# Altium schematic sheet MainPage.SchDoc
size A4; SheetNumber: 1; SheetTotal: 6
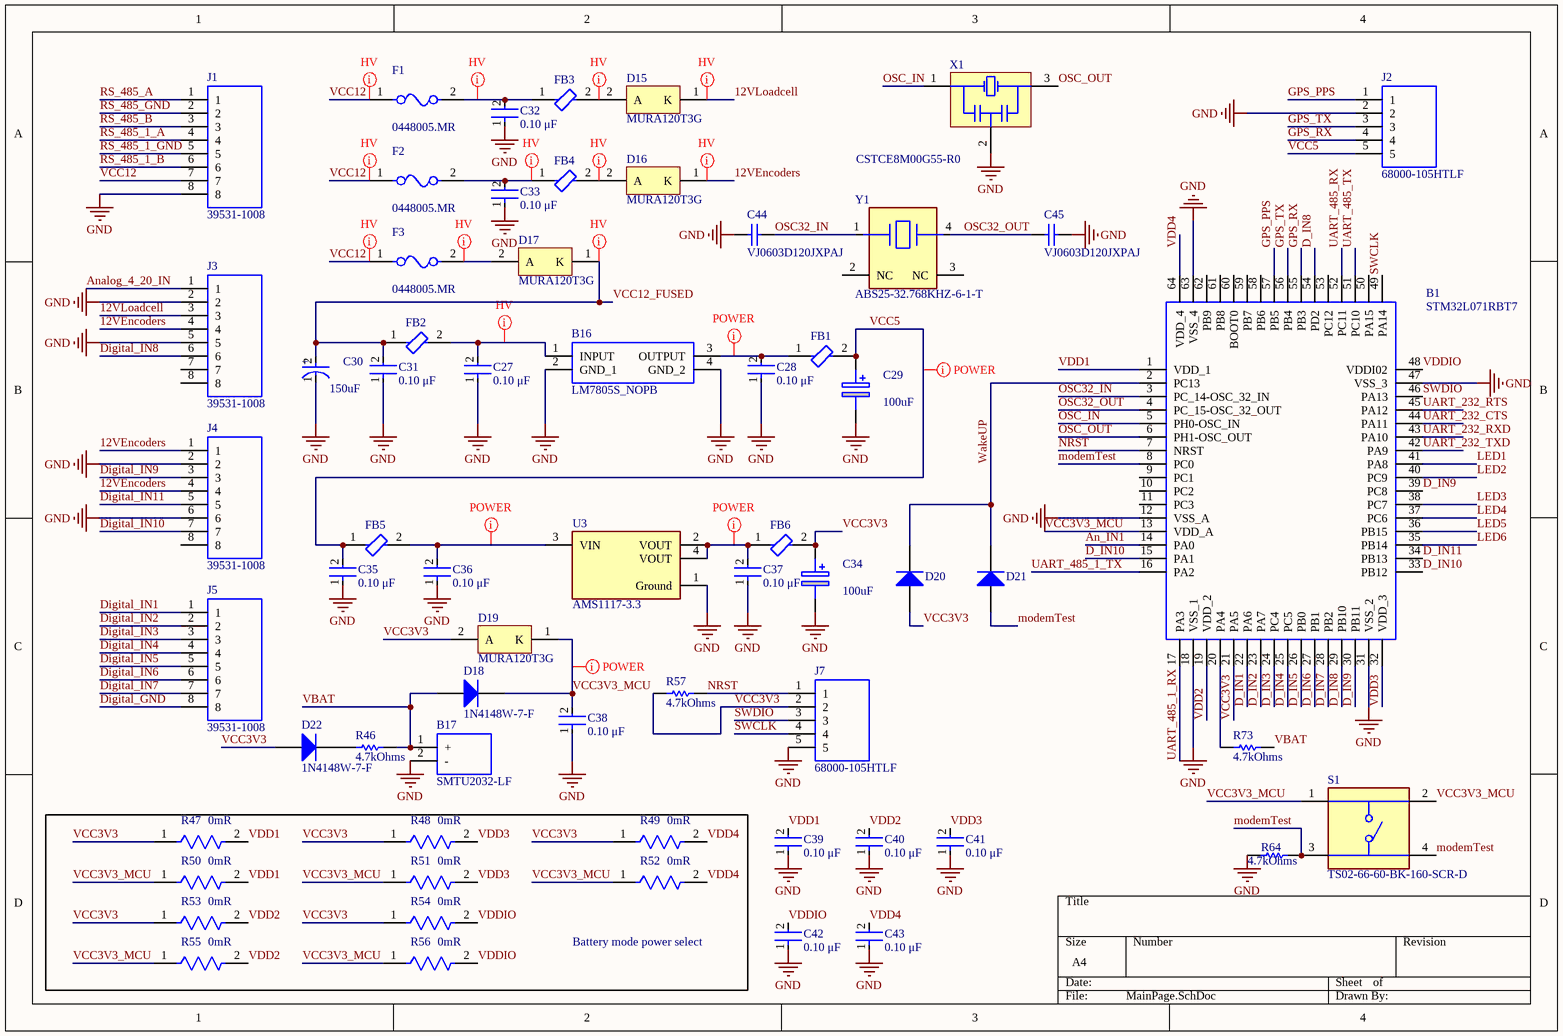
[diagram p0: MainPage.SchDoc]

## Parts
B1  STM32L071RBT7  [QFP50P1200X1200X160-64N]
B16  LM7805S_NOPB  [KTT0003B]
B17  SMTU2032-LF  [SMTU2032LF]
C27  value 0.10 μF  [FP-C0805C-DN-MFG]  (hidden comment: C0805C104K5RAC7411)
C28  value 0.10 μF  [FP-C0805C-DN-MFG]  (hidden comment: C0805C104K5RAC7411)
C29  Capacitance: 100uF  [T520B]  (hidden comment: T520B107M006ATE040)
C30  Capacitance: 150uF  [FP-TAJE-MFG]  (hidden comment: TAJE157K020RNJ)
C31  value 0.10 μF  [FP-C0805C-DN-MFG]  (hidden comment: C0805C104K5RAC7411)
C32  value 0.10 μF  [FP-C0805C-DN-MFG]  (hidden comment: C0805C104K5RAC7411)
C33  value 0.10 μF  [FP-C0805C-DN-MFG]  (hidden comment: C0805C104K5RAC7411)
C34  Capacitance: 100uF  [T520B]  (hidden comment: T520B107M006ATE040)
C35  value 0.10 μF  [FP-C0805C-DN-MFG]  (hidden comment: C0805C104K5RAC7411)
C36  value 0.10 μF  [FP-C0805C-DN-MFG]  (hidden comment: C0805C104K5RAC7411)
C37  value 0.10 μF  [FP-C0805C-DN-MFG]  (hidden comment: C0805C104K5RAC7411)
C38  value 0.10 μF  [FP-C0805C-DN-MFG]  (hidden comment: C0805C104K5RAC7411)
C39  value 0.10 μF  [FP-C0805C-DN-MFG]  (hidden comment: C0805C104K5RAC7411)
C40  value 0.10 μF  [FP-C0805C-DN-MFG]  (hidden comment: C0805C104K5RAC7411)
C41  value 0.10 μF  [FP-C0805C-DN-MFG]  (hidden comment: C0805C104K5RAC7411)
C42  value 0.10 μF  [FP-C0805C-DN-MFG]  (hidden comment: C0805C104K5RAC7411)
C43  value 0.10 μF  [FP-C0805C-DN-MFG]  (hidden comment: C0805C104K5RAC7411)
C44  VJ0603D120JXPAJ  [CAPC1608X92X38LL15T08]
C45  VJ0603D120JXPAJ  [CAPC1608X92X38LL15T08]
D15  MURA120T3G  [ONSC-SMA-2-403D-02_V]
D16  MURA120T3G  [ONSC-SMA-2-403D-02_V]
D17  MURA120T3G  [ONSC-SMA-2-403D-02_V]
D18  1N4148W-7-F  [DIOD-SOD123-2_V]
D19  MURA120T3G  [ONSC-SMA-2-403D-02_V]
D20  1N4148W-7-F  [DIOD-SOD123-2_V]  (value not drawn)
D21  1N4148W-7-F  [DIOD-SOD123-2_V]  (value not drawn)
D22  1N4148W-7-F  [DIOD-SOD123-2_V]
F1  0448005.MR  [FP-0448-MFG]
F2  0448005.MR  [FP-0448-MFG]
F3  0448005.MR  [FP-0448-MFG]
FB1  BLM41PG181SH1L  [FP-BLM41-0_2-a1_2-MFG]  (value not drawn)
FB2  BLM41PG181SH1L  [FP-BLM41-0_2-a1_2-MFG]  (value not drawn)
FB3  BLM41PG181SH1L  [FP-BLM41-0_2-a1_2-MFG]  (value not drawn)
FB4  BLM41PG181SH1L  [FP-BLM41-0_2-a1_2-MFG]  (value not drawn)
FB5  BLM41PG181SH1L  [FP-BLM41-0_2-a1_2-MFG]  (value not drawn)
FB6  BLM41PG181SH1L  [FP-BLM41-0_2-a1_2-MFG]  (value not drawn)
J1  39531-1008  [RHDR8W140P0X508_1X8_4264X830X1240P]
J2  68000-105HTLF  [HDRV5W67P0X254_1X5_1270X241X858P]
J3  39531-1008  [RHDR8W140P0X508_1X8_4264X830X1240P]
J4  39531-1008  [RHDR8W140P0X508_1X8_4264X830X1240P]
J5  39531-1008  [RHDR8W140P0X508_1X8_4264X830X1240P]
J7  68000-105HTLF  [HDRV5W67P0X254_1X5_1270X241X858P]
R46  Resistance: 4.7kOhms  [RESC1608X55X25LL10T15]  (hidden comment: RC0603FR-074K7L)
R47  Resistance: 0mR  [FP-CRCW0603-HPe3-MFG]  (hidden comment: CRCW06030000Z0EAHP)
R48  Resistance: 0mR  [FP-CRCW0603-HPe3-MFG]  (hidden comment: CRCW06030000Z0EAHP)
R49  Resistance: 0mR  [FP-CRCW0603-HPe3-MFG]  (hidden comment: CRCW06030000Z0EAHP)
R50  Resistance: 0mR  [FP-CRCW0603-HPe3-MFG]  (hidden comment: CRCW06030000Z0EAHP)
R51  Resistance: 0mR  [FP-CRCW0603-HPe3-MFG]  (hidden comment: CRCW06030000Z0EAHP)
R52  Resistance: 0mR  [FP-CRCW0603-HPe3-MFG]  (hidden comment: CRCW06030000Z0EAHP)
R53  Resistance: 0mR  [FP-CRCW0603-HPe3-MFG]  (hidden comment: CRCW06030000Z0EAHP)
R54  Resistance: 0mR  [FP-CRCW0603-HPe3-MFG]  (hidden comment: CRCW06030000Z0EAHP)
R55  Resistance: 0mR  [FP-CRCW0603-HPe3-MFG]  (hidden comment: CRCW06030000Z0EAHP)
R56  Resistance: 0mR  [FP-CRCW0603-HPe3-MFG]  (hidden comment: CRCW06030000Z0EAHP)
R57  Resistance: 4.7kOhms  [RESC1608X55X25LL10T15]  (hidden comment: RC0603FR-074K7L)
R64  Resistance: 4.7kOhms  [RESC1608X55X25LL10T15]  (hidden comment: RC0603FR-074K7L)
R73  Resistance: 4.7kOhms  [RESC1608X55X25LL10T15]  (hidden comment: RC0603FR-074K7L)
S1  TS02-66-60-BK-160-SCR-D  [SW_TS02-66-60-BK-160-SCR-D]
U3  AMS1117-3.3  [FP-AMS1117-IPC_C]
X1  CSTCE8M00G55-R0  [MURA-CSTCE_G_A-3_V]
Y1  ABS25-32.768KHZ-6-1-T  [FP-ABS25-MFG]

## Blocks framed on the sheet
Battery mode power select: R47-R56

## Nets
GND: B1.12(VSS_A) B1.18(VSS_1) B1.31(VSS_2) B1.47(VSS_3) B1.63(VSS_4) B16.2(GND_1) B16.4(GND_2) B17.2(-) C27.1 C28.1 C29.2(-) C30.1(C) C31.1 C32.1 C33.1 C34.2(-) C35.1 C36.1 C37.1 C38.1 C39.1 C40.1 C41.1 C42.1 C43.1 C44.1 C45.2 J1.8 J2.2 J3.2 J3.5 J4.2 J4.6 J7.5 R64.2 U3.1(Ground) X1.2(GND)
12VEncoders: D16.1(K) J3.4 J4.1 J4.4
12VLoadcell: D15.1(K) J3.3
An_IN1: B1.14(PA0)
Analog_4_20_IN: J3.1
D_IN1: B1.22(PA6)
D_IN2: B1.23(PA7)
D_IN3: B1.24(PC4)
D_IN4: B1.25(PC5)
D_IN5: B1.26(PB0)
D_IN6: B1.27(PB1)
D_IN7: B1.28(PB2)
D_IN8: B1.29(PB10) B1.54(PD2)
D_IN9: B1.30(PB11) B1.39(PC8)
D_IN10: B1.15(PA1) B1.33(PB12)
D_IN11: B1.34(PB13)
Digital_GND: J5.8
Digital_IN1: J5.1
Digital_IN2: J5.2
Digital_IN3: J5.3
Digital_IN4: J5.4
Digital_IN5: J5.5
Digital_IN6: J5.6
Digital_IN7: J5.7
Digital_IN8: J3.6
Digital_IN9: J4.3
Digital_IN10: J4.7
Digital_IN11: J4.5
GPS_PPS: B1.57(PB5) J2.1
GPS_RX: B1.55(PB3) J2.4
GPS_TX: B1.56(PB4) J2.3
LED1: B1.41(PA8)
LED2: B1.40(PC9)
LED3: B1.38(PC7)
LED4: B1.37(PC6)
LED5: B1.36(PB15)
LED6: B1.35(PB14)
modemTest: B1.8(PC0) D21.1(A) R64.1 S1.3 S1.4
NRST: B1.7(NRST) J7.1 R57.1
OSC32_IN: B1.3(PC_14-OSC_32_IN) C44.2 Y1.1
OSC32_OUT: B1.4(PC_15-OSC_32_OUT) C45.1 Y1.4
OSC_IN: B1.5(PH0-OSC_IN) X1.1(X1)
OSC_OUT: B1.6(PH1-OSC_OUT) X1.3(X2)
RS_485_1_A: J1.4
RS_485_1_B: J1.6
RS_485_1_GND: J1.5
RS_485_A: J1.1
RS_485_B: J1.3
RS_485_GND: J1.2
SWCLK: B1.49(PA14) J7.4
SWDIO: B1.46(PA13) J7.3
UART_232_CTS: B1.44(PA11)
UART_232_RTS: B1.45(PA12)
UART_232_RXD: B1.43(PA10)
UART_232_TXD: B1.42(PA9)
UART_485_1_RX: B1.17(PA3)
UART_485_1_TX: B1.16(PA2)
UART_485_RX: B1.52(PC11)
UART_485_TX: B1.51(PC10)
VBAT: B17.1(+) D18.1(A) R46.1 R73.1
VCC3V3: B1.21(PA5) C34.1(+) D19.2(A) D20.1(A) D22.1(A) FB6.2 J7.2 R47.1 R48.1 R49.1 R53.1 R54.1 R57.2
VCC3V3_MCU: B1.13(VDD_A) C38.2 D18.2(K) D19.1(K) R50.1 R51.1 R52.1 R55.1 R56.1 S1.1 S1.2
VCC5: C29.1(+) C35.2 FB1.2 FB5.1 J2.5
VCC12: F1.1 F2.1 F3.1 J1.7
VCC12_FUSED: C30.2(A) C31.2 D17.1(K) FB2.1
VDD1: B1.1(VDD_1) C39.2 R47.2 R50.2
VDD2: B1.19(VDD_2) C40.2 R53.2 R55.2
VDD3: B1.32(VDD_3) C41.2 R48.2 R51.2
VDD4: B1.64(VDD_4) C43.2 R49.2 R52.2
VDDIO: B1.48(VDDI02) C42.2 R54.2 R56.2
WakeUP: B1.2(PC13) D20.2(K) D21.2(K)
NetB1_20: B1.20(PA4) R73.2
NetB16_1: B16.1(INPUT) C27.2 FB2.2
NetB16_3: B16.3(OUTPUT) C28.2 FB1.1
NetC32_2: C32.2 F1.2 FB3.1
NetC33_2: C33.2 F2.2 FB4.1
NetC36_2: C36.2 FB5.2 U3.3(VIN)
NetC37_2: C37.2 FB6.1 U3.2(VOUT) U3.4(VOUT)
NetD15_2: D15.2(A) FB3.2
NetD16_2: D16.2(A) FB4.2
NetD17_2: D17.2(A) F3.2
NetD22_2: D22.2(K) R46.2

Not connected (* = marked no-connect by the designer): B1 9(PC1) 10(PC2) 11(PC3) 50(PA15) 53(PC12) 58(PB6) 59(PB7) 60(BOOT0) 61(PB8) 62(PB9); J3 7 8; J4 8; Y1 2(NC) 3(NC)

## Layout directives
net class HV: 12VEncoders, 12VLoadcell, NetB16_1, NetC32_2, NetC33_2, NetD15_2, NetD16_2, NetD17_2, VCC12, VCC12_FUSED
net class POWER: NetB16_3, NetC36_2, NetC37_2, VCC3V3_MCU, VCC5

## Notes on the sheet
- (in symbol CMP-2000-07229-2) +

## Library data of the parts
B1 = STM32L071RBT7: ARM Microcontrollers - MCU 16/32-BITS MICROS; Manufacturer_Name: STMicroelectronics; Geometry.Height: 1.6mm; Mouser Part Number: 511-STM32L071RBT7; Mouser Price/Stock: https://www.mouser.co.uk/ProductDetail/STMicroelectronics/STM32L071RBT7?qs=qzCNEk%252BRr%252BZjEtOUFC%252Bu7w%3D%3D; Manufacturer_Part_Number: STM32L071RBT7; Datasheet Link: http://www.st.com/content/ccc/resource/technical/document/datasheet/b5/24/80/11/51/59/47/f7/DM00141136.pdf/files/DM00141136.pdf/jcr:content/translations/en.DM00141136.pdf
B16 = LM7805S_NOPB: 1.5-A, Wide VIN Fixed Voltage Regulators; Manufacturer_Name: Texas Instruments; Manufacturer_Part_Number: LM7805S/NOPB; Mouser Part Number: 595-LM7805S/NOPB; Mouser Price/Stock: https://www.mouser.co.uk/ProductDetail/Texas-Instruments/LM7805S-NOPB?qs=9V2QonpqdTu8D%252Bva6DasHQ%3D%3D; Datasheet Link: http://www.ti.com/lit/gpn/lm7800
B17 = SMTU2032-LF: Coin Cell Battery Holders SFC MNT FOR CR2032; Manufacturer_Name: RENATA; Geometry.Height: 5mm; Mouser Part Number: 614-SMTU2032-LF; Mouser Price/Stock: https://www.mouser.co.uk/ProductDetail/Renata/SMTU2032-LF?qs=r1PAtlylphCLeXbokB9Tog%3D%3D; Manufacturer_Part_Number: SMTU2032-LF; Datasheet Link: https://componentsearchengine.com/Datasheets/1/SMTU2032-LF.pdf
C27 C28 C31-C33 C35-C43 = CMP-2007-00277-3: C0805 0.10 μF X7R 30ppm/°C 10.00% 50 V; Manufacturer: KEMET; Material: Ceramic; Tolerance: 0.1; Voltage Rating: 50 V; Temperature: -55°C to +125°C; Device Class L3: Ceramic Capacitors; Temperature Characteristic: X7R; Device Class L1: Passive Components; Category: Cap; Temperature Coefficient: 30ppm/°C; Manufacturer Part Number: C0805C104K5RAC7411; Temperature Range High: +125°C; Height: 0.88mm; RoHS: TRUE; ComponentLink2Description: Datasheet; Lead Free: Yes; Capacitance: 0.10 μF; Package: C0805C-DN; Temperature Range Low: -55°C; ComponentLink2URL: https://content.kemet.com/datasheets/KEM_C1003_C0G_SMD.pdf; Automotive: No; Ipc Land Pattern Name: CAPC200125X78; Octopart: https://octopart.com/c0805c104k5rac7411-kemet-18508045; Device Class L2: Capacitors
C29 C34 = T520B107M006ATE040: T520, Tantalum, Polymer Tantalum, Commercial Grade, 100 uF, 20%, 6.3 VDC, 105C, -55C, 105C, SMD, Polymer, Molded, Low ESR, Non-Combustible, 2,000 Hrs, 8 % , 40 mOhms, 63 uA, 94.85 mg, 3528, 1.9mm, Height Max = 2mm, 2000, 52  Weeks; Manufacturer_Name: KEMET; Mouser Part Number: 80-T520B107M6ATE40; Mouser Price/Stock: https://www.mouser.co.uk/ProductDetail/KEMET/T520B107M006ATE040?qs=A%2FUypIgi4aDLVIJ%2FABrGAw%3D%3D; Manufacturer_Part_Number: T520B107M006ATE040; Datasheet Link: https://content.kemet.com/datasheets/KEM_T2076_T52X-530.pdf; Geometry.Height: 2mm
C30 = CMP-2000-07229-2: 150uF 20V  ±10% 300mΩ 2917  SMD Tantalum Capacitor; Dissipation Factor: 8%; ESR (Equivalent Series Resistance): 300mR; Polarity: Polar; Leakage Current: 30uA; Dielectric Material: Tantalum; Height: 4.3mm; RoHS Compliant: Yes; Mount: Surface Mount; Voltage Rating: 20V; REACH SVHC: No SVHC; Height - Seated (Max): 0.169inch; Case Code (Imperial): 2917; Termination: SMD/SMT; Features: General Purpose; Case/Package: 2917; Max Operating Temperature: 125°C; Length: 7.3mm; Width: 4.3mm; Radiation Hardening: No; Construction: Flat; Voltage Rating (DC): 20V; Lead Free: Lead Free; Depth: 4.3mm; Tolerance: 10%; Series: TAJ; Min Operating Temperature: -55°C; Package Quantity: 1; Number of Pins: 2; Packaging: Tape and Reel; Case Code (Metric): 7343
C44 C45 = CMP-2006-01491-1: Manufacturer: Vitramon; Part Number: VJ0603D120JXPAJ
D15-D17 D19 = CMP-0902-00292-1: Surface Mount Ultrafast Power Rectifier, 2-Pin SMA, Pb-Free, Tape and Reel; Manufacturer: On Semiconductor; IFSM Max (A): 40; RoHS: TRUE; PackageVersion: Rev. G, 07/2012; DatasheetVersion: Rev. 8; Packing: Tape and Reel; ComponentLink2Description: Datasheet; ComponentLink3Description: Package Specification; ComponentLink2URL: http://www.onsemi.cn/pub_link/Collateral/MURA115T3-D.PDF; ComponentLink1URL: http://www.onsemi.com/; PartNumber: MURA120T3G; ComponentLink1Description: Manufacturer URL; Mounting Technology: Surface Mount; PackageDescription: 2-Pin Small Molded Package, J-Bend Lead, Body 2.605 x 4.315 mm; ComponentLink3URL: http://www.onsemi.com/pub_link/Collateral/403D-02.PDF; Type: Ultrafast; PackageReference: SMA-2-403D-02
D18 D20-D22 = CMP-2000-04932-2: Fast Switching Diode, 100 V, 0.15 A, -65 to 150 degC, 2-Pin?SOD123, RoHS, Tape and Reel; Recovery Time: 4ns; Brand: DiodesIncorporated; Unit Weight: 0.000353oz; Max Surge Current: 2A; Peak Reverse Voltage: 100V; Ir - Reverse Current: 1uA; Vf - Forward Voltage: 1.25V; Configuration: Single; If - Forward Current: 0.15A; Product Category: Diodes-GeneralPurpose,Power,Switching; Operating Temperature Range: -65Cto+150C; Packaging: Reel; Manufacturer URL: http://www.diodes.com/; Maximum Operating Temperature: +150C; Height: 1.25mm; Minimum Operating Temperature: -65C; Product: SwitchingDiodes; Package URL: http://www.diodes.com/datasheets/ds18004.pdf; Type: SwitchingDiode; Package Reference: SOD123-2; Width: 1.7mm; Datasheet URL: http://www.farnell.com/datasheets/1915529.pdf; Datasheet Version: Rev. 24-2, 10/2013; Series: 1N4148; Factory Pack Quantity: 3000; Length: 2.85mm; RoHS: True; Manufacturer: DiodesIncorporated; Mounting Style: SMD/SMT; Package / Case: SOD-123
F1-F3 = CMP-2000-05188-2: FUSE BRD MNT 5A 125VAC/VDC 2SMD; Manufacturer: Littelfuse; Max Fuse Ac Voltage: 125V; Fuse Blow Speed: Fast; Fuse Interrupt Ac Current: 50A; Value: 0.01531Ω; Fuse I2T: 4.49A2Sec; Device Class L3: unset; Lead Free: Yes; RoHS: TRUE; Max Fuse Dc Voltage: 125V; Mouser Description: Fuse Chip Very Fast Acting 5A 125V SMD Solder Pad 2410 Ceramic T/R CSA/PSE/UL; Package: 0448; Manufacturer Part Number: 0448005.MR; Device Class L2: Fuses; Fuse Current: 5A; Device Class L1: Circuit Protection; Octopart: https://octopart.com/0448005.mr-littelfuse-672815; ComponentLink2URL: https://www.littelfuse.com/~/media/electronics/datasheets/fuses/littelfuse_fuse_448_datasheet.pdf.pdf; Automotive: No; Digikey Description: FUSE BRD MNT 5A 125VAC/VDC 2SMD; Resistance: 0.01531Ω; Fuse Interrupt Dc Current: 50A; Temperature Range High: +125°C; Temperature: -55°C to +125°C; Voltage Rating: 125V; Category: Fuse; Height: 2.94mm; ComponentLink2Description: Datasheet; Temperature Range Low: -55°C
FB1-FB6 = CMP-06046-002023-1: Ferrite Bead, 1806, 180Ω @ 100MHz, 25%, 0.02Ω, 3.5A; Impedance: 180R; Number of Lines: 1; Max DC Current: 50mA; DC Resistance (DCR): 20mR; Mount: Surface Mount; Length: 4.5mm; Tolerance: 25%; Series: EMIFIL®, BLM41P; Package Quantity: 2500; Min Operating Temperature: -55°C; Max Operating Temperature: 125°C; Height: 0.071inch; Packaging: Tape and Reel; Contact Plating: Tin; Test Frequency: 100MHz; Ratings: AEC-Q200; Case Code (Metric): 4516; Termination: SMD/SMT; Case Code (Imperial): 1806; Width: 0.063inch; Max Current Rating: 3.5A; Case/Package: 1806
J1 J3-J5 = 39531-1008: Pluggable Terminal Blocks 5.08MM EURO HEADER VERT BLK 8CKT; Manufacturer_Name: Molex; Geometry.Height: 12.4mm; Mouser Part Number: 538-39531-1008; Mouser Price/Stock: https://www.mouser.co.uk/ProductDetail/Molex/39531-1008?qs=cJvWYcaovXy3iX%252BVkyK%252Bcg%3D%3D; Manufacturer_Part_Number: 39531-1008; Datasheet Link: https://www.molex.com/pdm_docs/sd/395311008_sd.pdf
J2 J7 = 68000-105HTLF: 68000-105HTLF-B/S SR HDR 1*5; Manufacturer_Name: Amphenol Communication Solutions; Geometry.Height: 8.58mm; Mouser Part Number: 649-68000-105HTLF; Mouser Price/Stock: https://www.mouser.co.uk/ProductDetail/Amphenol-FCI/68000-105HTLF?qs=w%2Fv1CP2dgqrYgNyQVoiqDw%3D%3D; Manufacturer_Part_Number: 68000-105HTLF; Datasheet Link: https://cdn.amphenol-cs.com/media/wysiwyg/files/drawing/68000.pdf
R46 R57 R64 R73 = CMP-2000-06942-1: Chip Resistor, 4.7 KOhm, +/- 1%, 0.1 W, -55 to 155 degC, 0603 (1608 Metric), RoHS, Tape and Reel; Manufacturer: Yageo; Power Rating: 100mW; Temperature Coefficient: 100PPM/C; Voltage Rating: 50V; Package Reference: 0603; Series: RC; Datasheet Version: Rev. 7, 05/2017; Packaging: Reel; Termination Style: SMD/SMT; Datasheet URL: http://www.yageo.com/documents/recent/PYu-RC_Group_51_RoHS_L_7.pdf; Manufacturer URL: http://www.yageo.com/; Package Description: 2-Pin Surface Mount Device, Body 1.6 x 0.8 mm; Case Code - mm: 1608; Case Code - in: 0603; Mounting Technology: SurfaceMount; Operating Temperature Range: -55Cto+155C; Tolerance: 1%; Product: ThickFilmResistorsGeneralPurpose
R47-R56 = CMP-2000-03817-2: RES Thick Film, 0Ω, , 0.33W, , 0603; Max Power Dissipation: 250mW; Voltage Rating (DC): 75V; Temperature Coefficient: 0ppm/°C; Mount: Surface Mount; Package Quantity: 5000; Features: Automotive AEC-Q200; Length: 1.6mm; Width: 0.033inch; Min Operating Temperature: -55°C; Max Operating Temperature: 155°C; Contact Plating: Tin; Depth: 0.85mm; Case/Package: 0603; Radiation Hardening: No; Military Standard: Not; Power Rating: 250mW; Height: 0.45mm; Composition: Thick Film; Lead Free: Lead Free; Voltage Rating: 75V; Case Code (Imperial): 0603; Weight: 7.1E-05oz; Number of Terminations: 2; Packaging: Tape and Reel; Number of Pins: 2; Case Code (Metric): 1608; Termination: SMD/SMT
U3 = CMP-209535-000001-1: LDO Voltage Regulators 1A, 3.3V; Manufacturer: Advanced Monolithic Systems; Dropout Voltage: 1.1V; Output Type: Fixed; Nominal Supply Current: 5mA; Max Power Dissipation: 1.2W; Max Supply Voltage: 15V; Number Of Outputs: 1; Standoff Height: 0.64mm; Max Junction Temp: +125°C; Height: 1.8mm; Package: AMS1117; Device Class L2: Power Management ICs; ComponentLink2Description: Datasheet; ComponentLink2URL: http://www.advanced-monolithic.com/pdf/ds1117.pdf; Category: IC; RoHS: TRUE; Automotive: No; Device Class L1: Integrated Circuits (ICs); Output Current: 1A; Device Class L3: Voltage Regulators - Linear; Temperature: -40°C to +125°C; Output Voltage: 3.3V; Manufacturer Part Number: AMS1117-3.3; Temperature Range Low: -40°C; Octopart: https://octopart.com/ams1117-3.3-advanced+monolithic+systems-25899300; Lead Free: Yes; Ipc Land Pattern Name: SOT229P700X180-4; Temperature Range High: +125°C
X1 = CMP-2100-03620-1: Ceramic Resonator, 8 MHz, +/- 0.5%, -20 to 80 degC, 3-Pin SMD, RoHS, Tape and Reel; Manufacturer: Murata; Capacitance: 33pF; Frequency Stability: 0.2%; Self Resonant Frequency: 8MHz; Datasheet Version: 42339.0; RoHSCompliant: True; Datasheet URL: http://www.murata.com/~/media/webrenewal/support/library/catalog/products/timingdevice/ceralock/p16e.ashx; Case/Package: Ceramic; Load Capacitance: 33pF; Tolerance: 0.5%; Mount: SurfaceMount; Height: 0.031inch; Number of Pins: 3; Package Description: 3-Pin Surface Mount Device, Body 3.2 x 1.3 mm, Pitch 1.2 mm; Package Quantity: 1; Lead Free: LeadFree; Contact Plating: Gold; REACH SVHC: NoSVHC; Length: 0.126inch; Width: 0.051inch; Manufacturer URL: http://www.murata.com/; Packaging: TapeandReel; Termination: SMD/SMT; Frequency Tolerance: 0.5%; Max Operating Temperature: 80degC; Composition: Ceramic; Package Reference: CSTCE_G_A-3; Min Operating Temperature: -20degC; Frequency: 8MHz
Y1 = CMP-27762-013076-1: CRYSTAL 32.7680KHZ 6PF SMD; ESR (Equivalent Series Resistance): 50kR; Frequency Tolerance: 10ppm; Series Resistance: 50kR; Frequency: 32.768kHz; Length: 8mm; Load Capacitance: 6pF; Packaging: Tape and Reel; Radiation Hardening: No; Min Operating Temperature: -40°C; Lead Free: Lead Free; Height: 0.098inch; Termination: SMD/SMT; Case/Package: SMD/SMT; Max Operating Temperature: 85°C; Mount: Surface Mount; Depth: 3.8mm; RoHS Compliant: Yes; Series: ABS25; Package Quantity: 3000; Operating Frequency: 32.768 kHz; Number of Pins: 4; Tolerance: 10ppm; Width: 0.15inch; REACH SVHC: No SVHC
S1 = TS02-66-60-BK-160-SCR-D: Price: None; MP: TS02-66-60-BK-160-SCR-D; Availability: Unavailable; Package: None; Value: *